# Altium project PCB_Project_A_RemoteGIT.PrjPcb
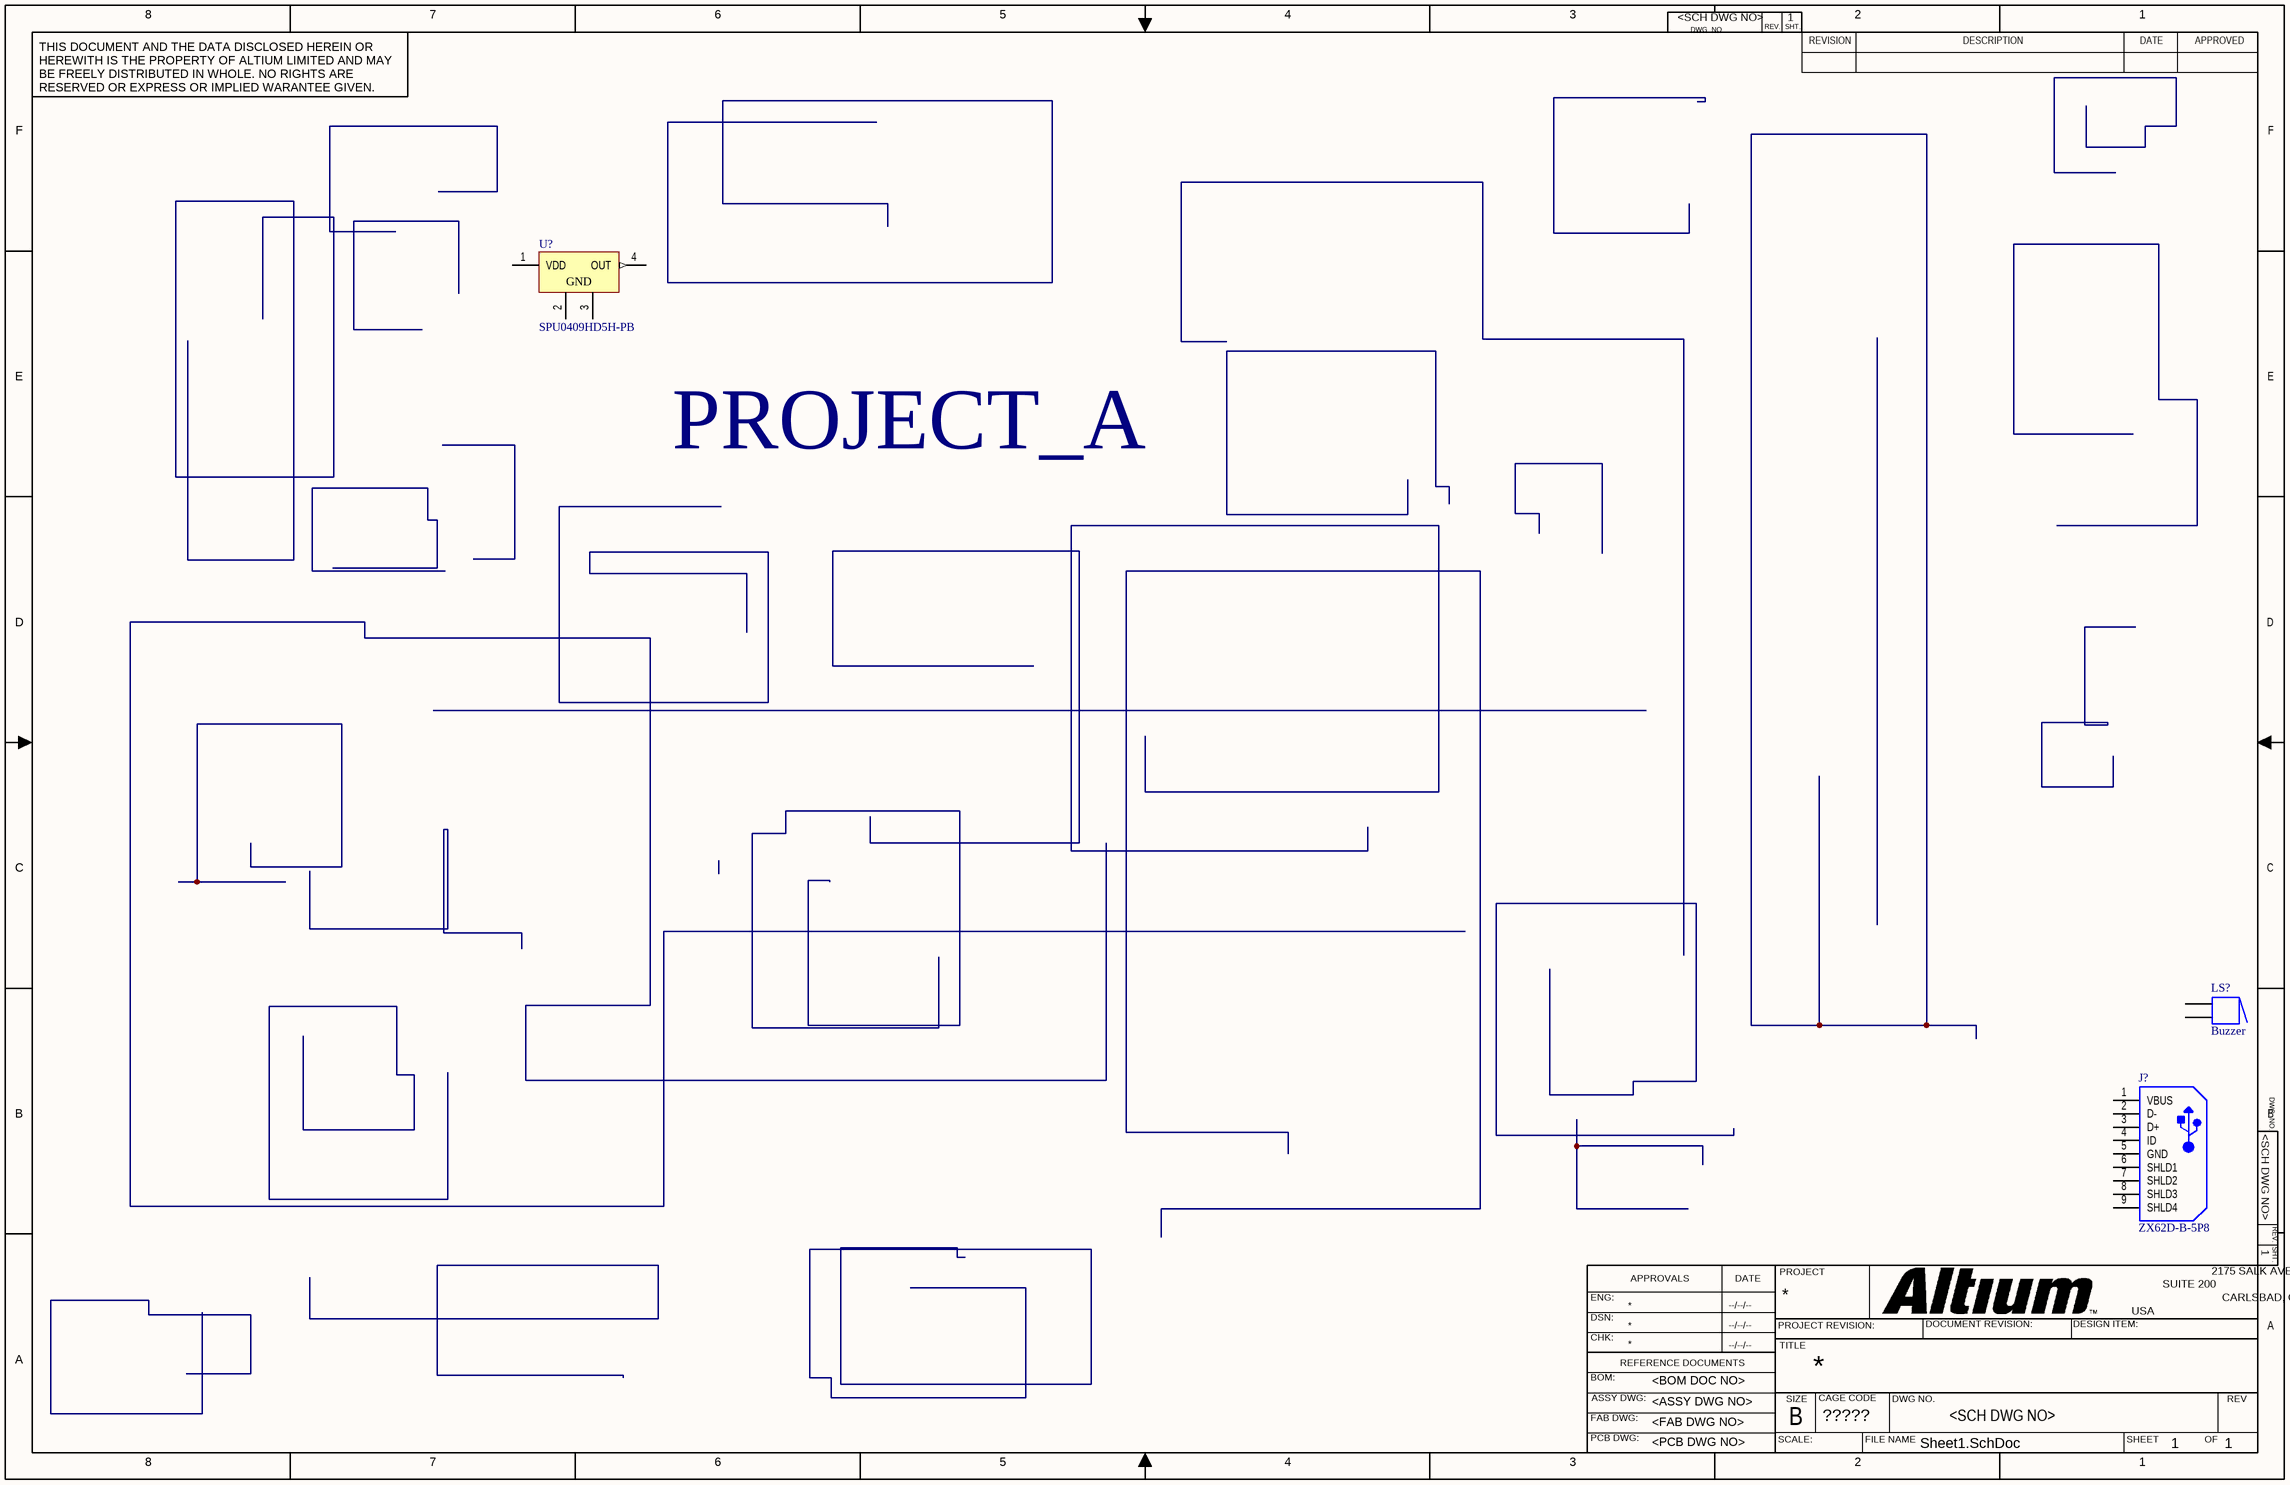
[diagram p0: Sheet1.SchDoc]
CAGE_CODE: ?????; CONTRACT_NUMBER: <CONTRACT NO>; DOC_NO_ASSY_DWG: <ASSY DWG NO>; DOC_NO_BOM: <BOM DOC NO>; DOC_NO_FAB_DWG: <FAB DWG NO>; DOC_NO_SCH_DWG: <SCH DWG NO>; PCB_2_DEC_TOL: +/-.01; PCB_3_DEC_TOL: +/-.010; PCB_ANG_TOL: +/-1/2; PCB_ASSEMBLY_NO: <PCB ASSY NO>; PCB_CHECKER: - -----; PCB_CHECKER_APP_DATE: --/--/----; PCB_DESIGNER: - -----; PCB_DESIGNER_APP_DATE: --/--/----; PCB_DWG_NO: <PCB DWG NO>; PCB_ENGINEER: - -----; PCB_ENGINEER_APP_DATE: --/--/----; PCB_PART_NUMBER: <PCB PN>; PCB_REV: A; SCH_REV: A
1 sheet, 3 parts. Net scope: global (net labels, ports and power ports of the same name join across sheets).
Board file: PCB1.PcbDoc

## Sheet Sheet1.SchDoc
size 431 x 279 mm; DocumentNumber: 1; SheetNumber: 1; SheetTotal: 1; ENG_APP_DATE: --/--/--; DSN_APP_DATE: --/--/--; CHK_APP_DATE: --/--/--

### Parts
J?  ZX62D-B-5P8  [HIRO-ZX62D-B-5P8_V]
LS?  Buzzer  [ABSM-1574]
U?  SPU0409HD5H-PB  [KNOW-SPU0409HD5H-PB_V]

### Nets
NetLS?_1: LS?.1 LS?.1A
NetLS?_2: LS?.2 LS?.2A

Not connected (* = marked no-connect by the designer): J? 1(VBUS) 2(D-) 3(D+) 4(ID) 5(GND) 6(SHLD1) 7(SHLD2) 8(SHLD3) 9(SHLD4); U? 1(VDD) 2(GROUND) 3(GROUND) 4(OUT)

### Notes on the sheet
- PROJECT_A
- 8
- 7
- 6
- 5
- 4
- 3
- DWG. NO.
- REV.
- SHT.
- 2
- 1
- THIS DOCUMENT AND THE DATA DISCLOSED HEREIN OR HEREWITH IS THE PROPERTY OF ALTIUM LIMITED AND MAY BE FREELY DISTRIBUTED IN WHOLE. NO RIGHTS ARE RESERVED OR EXPRESS OR IMPLIED WARANTEE GIVEN.
- REVISION
- DESCRIPTION
- DATE
- APPROVED
- F
- E
- D
- C
- B
- ENG:
- APPROVALS
- PROJECT
- SUITE 200
- 2175 SALK AVENUE
- CARLSBAD, CA 92008
- A
- DSN:
- CHK:
- REFERENCE DOCUMENTS
- PROJECT REVISION:
- TITLE
- DOCUMENT REVISION:
- DESIGN ITEM:
- USA
- BOM:
- FAB DWG:
- PCB DWG:
- ASSY DWG:
- SCALE:
- SIZE
- CAGE CODE
- FILE NAME
- DWG NO.
- SHEET
- OF
- REV
- (in symbol CMP-00027-00001-1) GND

### Library data of the parts
J? = CMP-002-00043-1: Right Angle Receptacle Connector, Micro USB, 5 Position, Height 2.65 mm, -30 to 85 degC, RoHS, Tape and Reel; Manufacturer: Hirose Electric; Current Rating: 1A; Gender: Male; Rows: 1; Min Operating Temperature: -30°C; Packaging: TapeandReel; Contact Material: Copper; Lead Pitch: 0.65mm; Package Quantity: 2000; RoHS Compliant: True; Max Operating Temperature: 85°C; Pins: 5; Datasheet URL: https://www.hirose.com/product/en/download_file/key_name/ZX62D-B-5P8/category/Catalog/doc_file_id/31704/?file_category_id=5&item_id=02420034000&is_series=; Package Description: USB Connector, 5 Position Surface Mount, Length 8 mm, Height 2.65 mm; Mounting Technology: SM; Housing Material: Plastic; Case/Package: ZX62D-B-5P8; Datasheet Version: Aug-16; Connector Type: USB; Manufacturer URL: https://www.hirose.com; Package URL: https://www.hirose.com/product/en/download_file/key_name/ZX62D-B-5P8/category/Drawing%20(2D)/doc_file_id/36535/?file_category_id=6&item_id=02420034000&is_series=; Package Reference: ZX62D-B-5P8; Contact Plating: Gold
LS? = Buzzer: Magnetic Transducer Buzzer; Published: 24-Mar-1999; LatestRevisionDate: 17-Dec-2003; LatestRevisionNote: Schematic revised, PCB Footprint replaced.; DatasheetVersion: 17-Dec-2003; PackageReference: ABSM-1574; Publisher: Altium Limited; PackageDescription: Magnetic Transducer Buzzer; ComponentLink1Description: Manufacturer Link; ComponentLink1URL: http://www.megastar.com/linecard/buzzmode/index.php
U? = CMP-00027-00001-1: SiSonic(TM) Microphone, 1.5 to 3.6 V, -40 to 100 degC, 4-Pin SMD, RoHS, Tape and Reel; Manufacturer: Knowles Acoustics; Voltage Rating: 3.6V; Impedance: 100Ohm; Package Quantity: 1200; RoHS Compliant: True; Manufacturer URL: http://www.knowles.com/; Datasheet URL: http://datasheet.octopart.com/SPU0409HD5H-PB-Knowles-Acoustics-datasheet-17019172.pdf; Package Reference: SPU0409HD5H-PB; Case/Package: SPU0409HD5H-PB; Mounting Technology: SM; Packaging: TapeandReel; Package Description: 4-Pin Surface Mount Device, Body 3.76 x 2.95 mm; Datasheet Version: Rev. F, 03/2013